# EAGLE design Breakouts1a (EAGLE 7.4.0)
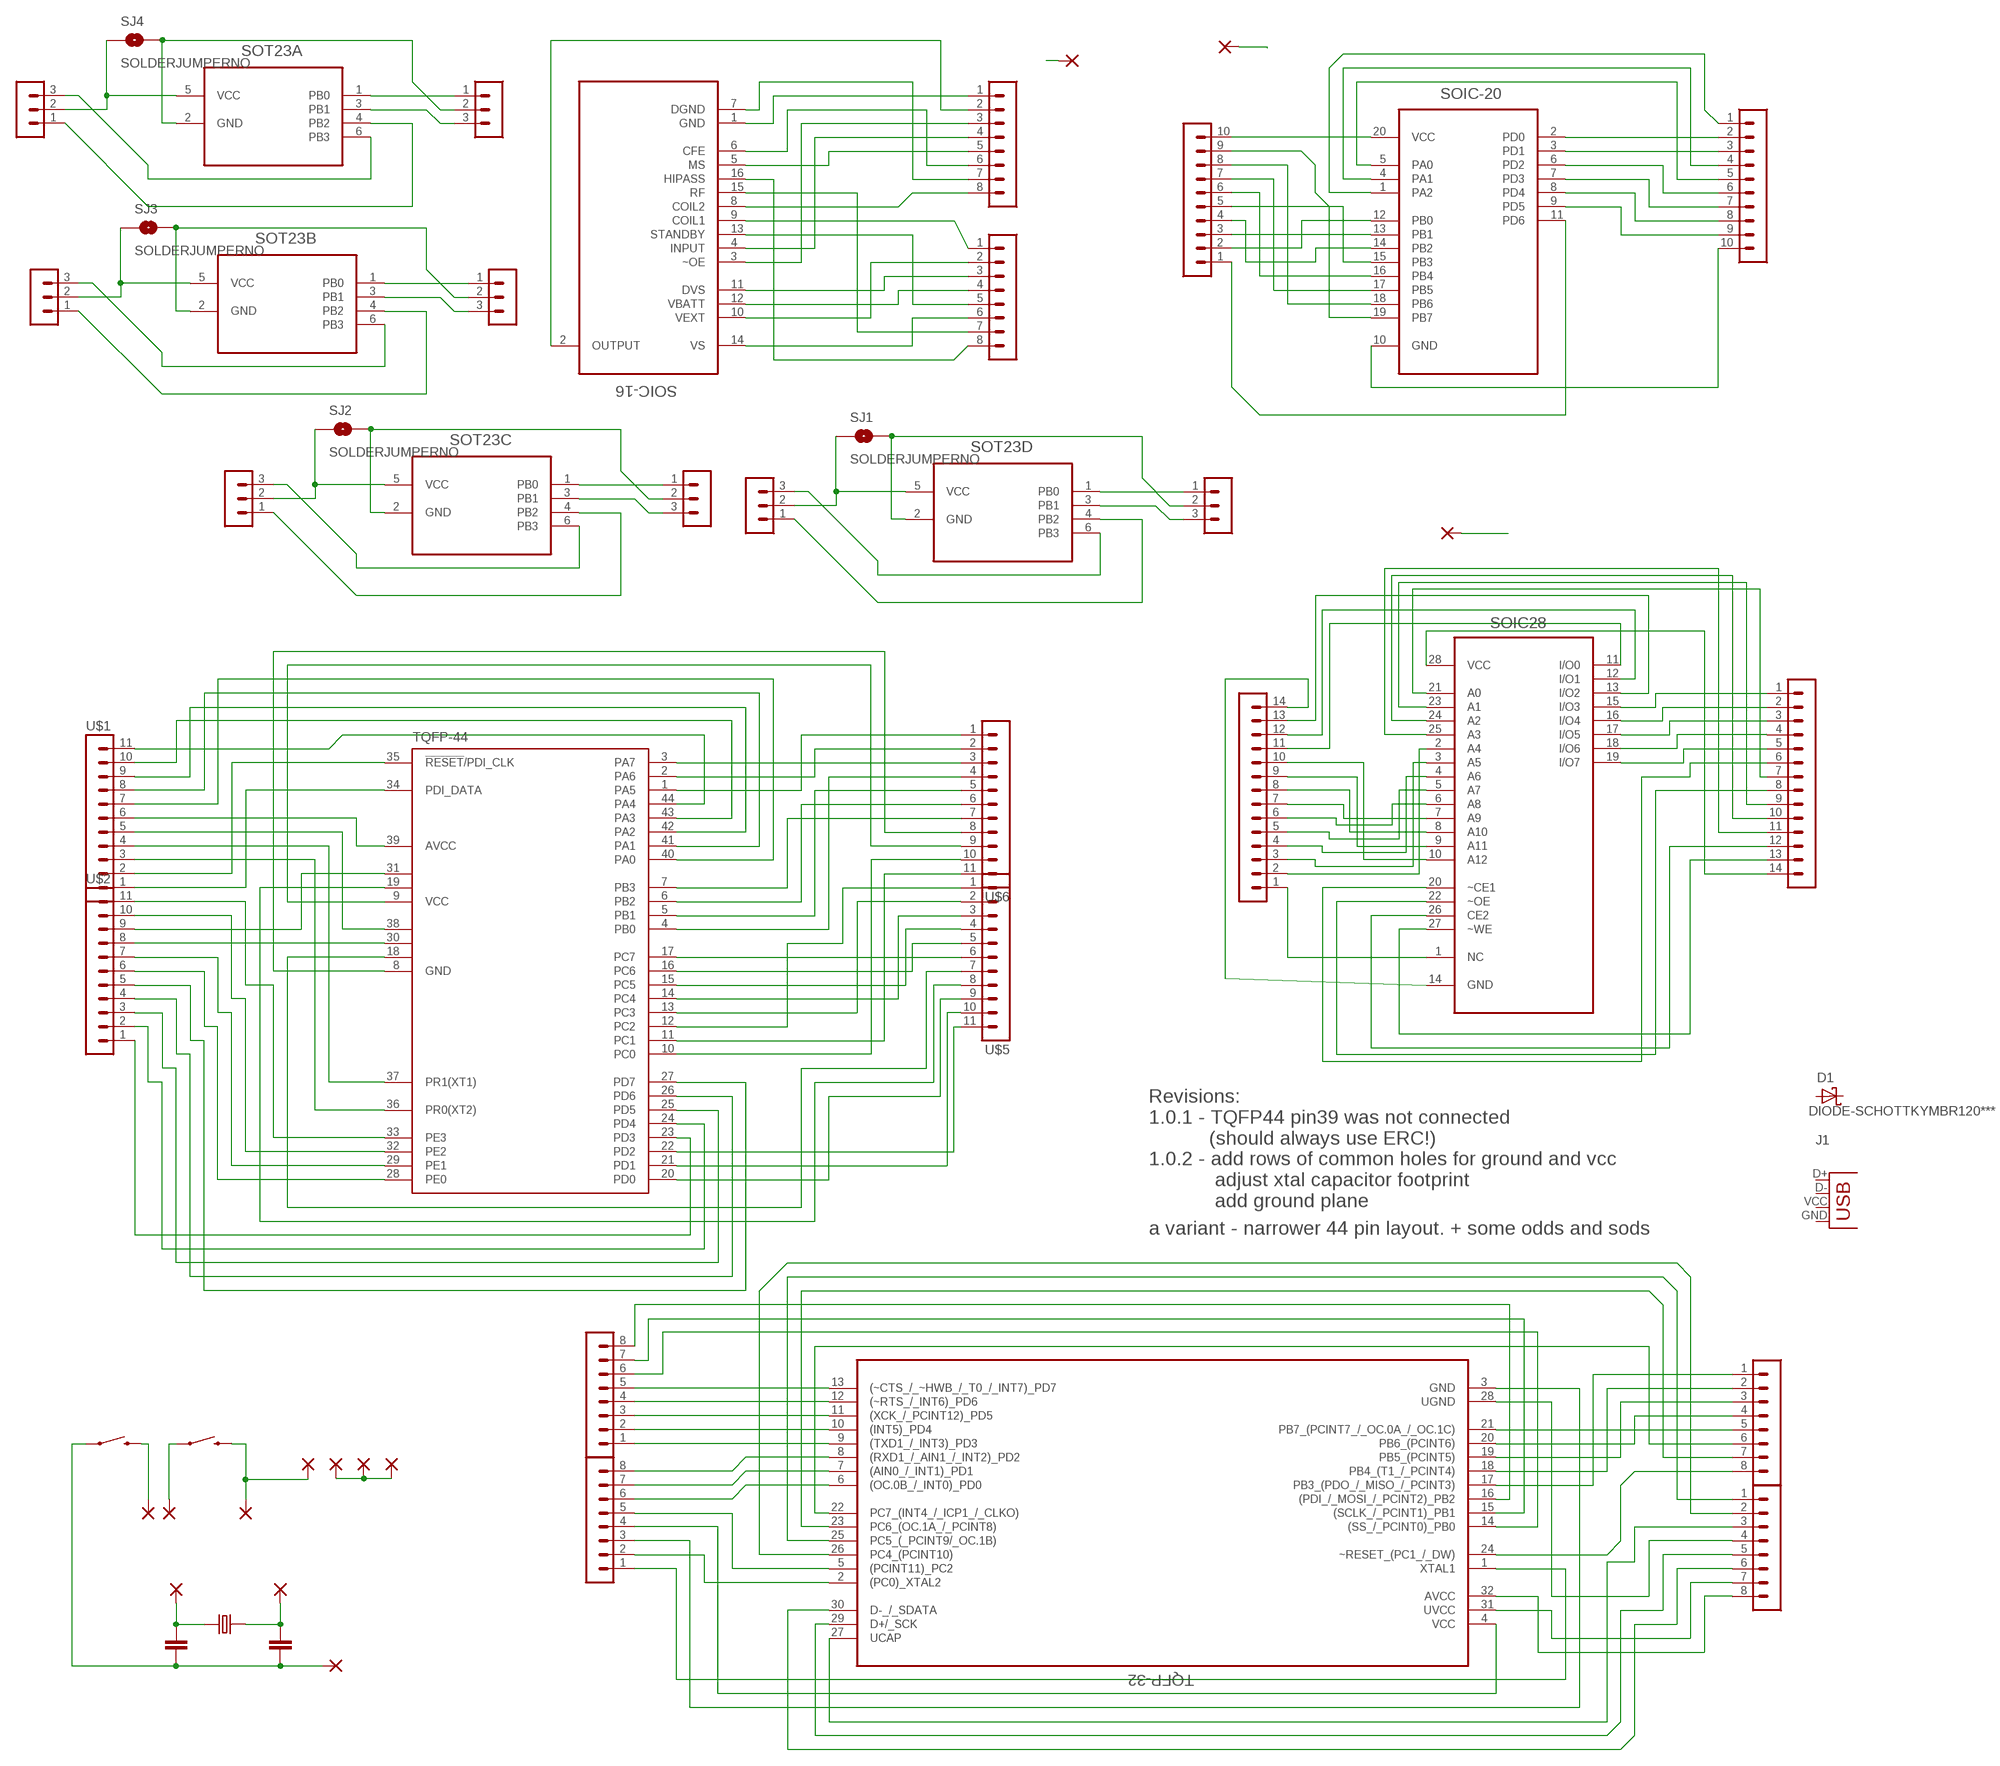
[diagram p0: schematic, sheet 1]

## Parts
C1  C-EU025-024X044**100NF+22PF  [C025-024X044]
C2  C-EU025-024X044**100NF+22PF  [C025-024X044]
D1  DIODE-SCHOTTKYMBR120***  [SOD123]
J1  USB-FCI_SMD***  [FCI_USB_B_SMD]
PAD1  WIREPAD1,6/0,8  [1,6/0,8]
PAD3  WIREPAD1,6/0,8  [1,6/0,8]
PAD4  WIREPAD1,6/0,8  [1,6/0,8]
PAD6  WIREPAD1,6/0,8  [1,6/0,8]
PAD7  WIREPAD1,6/0,8  [1,6/0,8]
PAD8  WIREPAD1,6/0,8  [1,6/0,8]
PAD15  WIREPAD1,6/0,8  [1,6/0,8]
PAD16  WIREPAD1,6/0,8  [1,6/0,8]
PAD17  WIREPAD1,6/0,8  [1,6/0,8]
PAD18  WIREPAD1,6/0,8  [1,6/0,8]
PLANE-SOIC16  WIREPAD1,6/0,8  [1,6/0,8]
PLANE-SOIC20  WIREPAD1,6/0,8  [1,6/0,8]
PLANE-SOIC28  WIREPAD1,6/0,8  [1,6/0,8]
S1  SWITCH-MOMENTARY-2PTH  [TACTILE-PTH]
S2  SWITCH-MOMENTARY-2PTH  [TACTILE-PTH]
SJ1  SOLDERJUMPERNO  [SJ_2S-NO]
SJ2  SOLDERJUMPERNO  [SJ_2S-NO]
SJ3  SOLDERJUMPERNO  [SJ_2S-NO]
SJ4  SOLDERJUMPERNO  [SJ_2S-NO]
SOIC28  CY6264-70SNXC  [SOIC127P1193X253-28N]
SOIC-16  U2270B-MFPY  [SOIC127P600X140-16N]
SOIC-20  ATTINY2313A-SU  [SOIC127P1032X265-20N]
SOT23A  ATTINY10-TSHR  [SOT95P280X145-6N]
SOT23B  ATTINY10-TSHR  [SOT95P280X145-6N]
SOT23C  ATTINY10-TSHR  [SOT95P280X145-6N]
SOT23D  ATTINY10-TSHR  [SOT95P280X145-6N]
SV1  MA08-1  [MA08-1]
SV2  MA08-1  [MA08-1]
SV4  MA08-1  [MA08-1]
SV5  MA14-1  [MA14-1]
SV6  MA10-1  [MA10-1]
SV8  MA08-1  [MA08-1]
SV9  MA14-1  [MA14-1]
SV10  MA03-1  [MA03-1]
SV11  MA03-1  [MA03-1]
SV12  MA03-1  [MA03-1]
SV13  MA03-1  [MA03-1]
SV14  MA03-1  [MA03-1]
SV15  MA03-1  [MA03-1]
SV16  MA08-1  [MA08-1]
SV17  MA10-1  [MA10-1]
SV18  MA08-1  [MA08-1]
SV21  MA03-1  [MA03-1]
SV22  MA03-1  [MA03-1]
TQFP-32  AT90USB162-16AU  [QFP80P900X900X120-32N]
TQFP-44  XMEGA16A4A  [TQFP44]
U$1  MA11-1  [MA11-1S]
U$2  MA11-1  [MA11-1S]
U$5  MA11-1  [MA11-1S]
U$6  MA11-1  [MA11-1S]
X1  CRYSTAL-HC49U-V**16MHZ  [HC49U-V]

## Nets
GND: C1.2 C2.2 PAD8.1(P) S1.1
N$1: TQFP-44.1(PA5) U$6.1
N$2: TQFP-44.2(PA6) U$6.2
N$3: TQFP-44.3(PA7) U$6.3
N$4: TQFP-44.4(PB0) U$6.4
N$5: TQFP-44.5(PB1) U$6.5
N$6: TQFP-44.6(PB2) U$6.6
N$7: TQFP-44.7(PB3) U$6.7
N$8: TQFP-44.8(GND) U$6.8
N$9: TQFP-44.9(VCC) U$6.9
N$10: TQFP-44.12(PC2) U$5.1
N$11: TQFP-44.11(PC1) U$6.11
N$12: TQFP-44.10(PC0) U$6.10
N$13: TQFP-44.13(PC3) U$5.2
N$14: TQFP-44.14(PC4) U$5.3
N$15: TQFP-44.15(PC5) U$5.4
N$16: TQFP-44.16(PC6) U$5.5
N$17: TQFP-44.17(PC7) U$5.6
N$18: TQFP-44.18(GND1) U$5.7
N$19: TQFP-44.19(VCC1) U$5.8
N$20: TQFP-44.20(PD0) U$5.9
N$21: TQFP-44.21(PD1) U$5.10
N$22: TQFP-44.22(PD2) U$5.11
N$23: TQFP-44.23(PD3) U$2.1
N$24: TQFP-44.24(PD4) U$2.2
N$25: SOIC28.1(NC) SV9.1
N$26: SOIC28.2(A4) SV9.2
N$27: SOIC28.3(A5) SV9.3
N$28: SOIC28.4(A6) SV9.4
N$29: SOIC28.5(A7) SV9.5
N$30: SOIC28.6(A8) SV9.6
N$31: SOIC28.7(A9) SV9.7
N$32: SOIC28.8(A10) SV9.8
N$33: TQFP-44.25(PD5) U$2.3
N$34: TQFP-44.26(PD6) U$2.4
N$35: TQFP-44.27(PD7) U$2.5
N$36: TQFP-44.28(PE0) U$2.6
N$37: TQFP-44.29(PE1) U$2.7
N$38: TQFP-44.30(GND2) U$2.8
N$39: TQFP-44.31(VCC2) U$2.9
N$40: TQFP-44.32(PE2) U$2.10
N$41: TQFP-44.33(PE3) U$2.11
N$42: TQFP-44.34(PDI_DATA) U$1.1
N$43: TQFP-44.35(!RESET!/PDI_CLK) U$1.2
N$44: TQFP-44.36(PR0(XT2)) U$1.3
N$45: TQFP-44.37(PR1(XT1)) U$1.4
N$46: SOIC-20.1(PA2) SV6.1
N$47: SOIC-20.2(PD0) SV6.2
N$48: SOIC-20.3(PD1) SV6.3
N$49: SOIC-20.4(PA1) SV6.4
N$50: SOIC-20.5(PA0) SV6.5
N$51: SOIC-20.6(PD2) SV6.6
N$52: SOIC-20.7(PD3) SV6.7
N$53: SOIC-20.8(PD4) SV6.8
N$54: SOIC-20.9(PD5) SV6.9
N$55: SOIC-20.10(GND) SV6.10
N$56: SOIC-20.11(PD6) SV17.1
N$57: SOIC-20.12(PB0) SV17.2
N$58: SOIC-20.13(PB1) SV17.3
N$59: SOIC-20.14(PB2) SV17.4
N$60: SOIC-20.15(PB3) SV17.5
N$61: SOIC-20.16(PB4) SV17.6
N$62: SOIC-20.18(PB6) SV17.8
N$63: SOIC-20.19(PB7) SV17.9
N$64: SOIC-20.20(VCC) SV17.10
N$65: TQFP-44.38(GND3) U$1.5
N$66: TQFP-44.39(AVCC) U$1.6
N$67: TQFP-44.40(PA0) U$1.7
N$68: TQFP-44.41(PA1) U$1.8
N$69: TQFP-44.42(PA2) U$1.9
N$70: TQFP-44.43(PA3) U$1.10
N$71: TQFP-44.44(PA4) U$1.11
N$72: SOIC-20.17(PB5) SV17.7
N$73: SV16.2 TQFP-32.2((PC0)_XTAL2)
N$74: SV16.1 TQFP-32.1(XTAL1)
N$75: SV16.5 TQFP-32.5((PCINT11)_PC2)
N$76: SV16.6 TQFP-32.6((OC.0B_/_INT0)_PD0)
N$77: SV16.7 TQFP-32.7((AIN0_/_INT1)_PD1)
N$78: SV16.8 TQFP-32.8((RXD1_/_AIN1_/_INT2)_PD2)
N$79: SV18.1 TQFP-32.9((TXD1_/_INT3)_PD3)
N$80: SV18.2 TQFP-32.10((INT5)_PD4)
N$81: SV18.3 TQFP-32.11((XCK_/_PCINT12)_PD5)
N$82: SV18.4 TQFP-32.12((~RTS_/_INT6)_PD6)
N$83: SV18.5 TQFP-32.13((~CTS_/_~HWB_/_T0_/_INT7)_PD7)
N$84: SV16.4 TQFP-32.4(VCC)
N$85: SV16.3 TQFP-32.3(GND)
N$86: SV18.8 TQFP-32.16((PDI_/_MOSI_/_PCINT2)_PB2)
N$87: SV18.7 TQFP-32.15((SCLK_/_PCINT1)_PB1)
N$88: SV18.6 TQFP-32.14((SS_/_PCINT0)_PB0)
N$89: SV4.1 TQFP-32.17(PB3_(PDO_/_MISO_/_PCINT3))
N$90: SV4.2 TQFP-32.18(PB4_(T1_/_PCINT4))
N$91: SV4.3 TQFP-32.19(PB5_(PCINT5))
N$92: SV4.4 TQFP-32.20(PB6_(PCINT6))
N$93: SV4.5 TQFP-32.21(PB7_(PCINT7_/_OC.0A_/_OC.1C))
N$94: SV4.6 TQFP-32.22(PC7_(INT4_/_ICP1_/_CLKO))
N$95: SV4.7 TQFP-32.23(PC6_(OC.1A_/_PCINT8))
N$96: SV4.8 TQFP-32.24(~RESET_(PC1_/_DW))
N$97: SV8.1 TQFP-32.25(PC5_(_PCINT9/_OC.1B))
N$98: SV8.2 TQFP-32.26(PC4_(PCINT10))
N$99: SV8.3 TQFP-32.27(UCAP)
N$100: SV8.4 TQFP-32.28(UGND)
N$101: SV8.5 TQFP-32.29(D+/_SCK)
N$102: SV8.6 TQFP-32.30(D-_/_SDATA)
N$103: SV8.7 TQFP-32.31(UVCC)
N$104: SV8.8 TQFP-32.32(AVCC)
N$105: SOIC-16.1(GND) SV1.1
N$106: SOIC-16.2(OUTPUT) SV1.2
N$107: SOIC-16.3(~OE) SV1.3
N$108: SOIC-16.4(INPUT) SV1.4
N$109: SOIC-16.5(MS) SV1.5
N$110: SOIC-16.6(CFE) SV1.6
N$111: SOIC-16.7(DGND) SV1.7
N$112: SOIC-16.8(COIL2) SV1.8
N$113: SOIC-16.9(COIL1) SV2.1
N$114: SOIC-16.10(VEXT) SV2.2
N$115: SOIC-16.11(DVS) SV2.3
N$116: SOIC-16.12(VBATT) SV2.4
N$117: SOIC-16.13(STANDBY) SV2.5
N$118: SOIC-16.14(VS) SV2.6
N$119: SOIC-16.15(RF) SV2.7
N$120: SOIC-16.16(HIPASS) SV2.8
N$121: SOT23C.1(PB0) SV22.1
N$122: SJ2.2 SOT23C.2(GND) SV22.2
N$123: SOT23C.3(PB1) SV22.3
N$124: SOT23C.4(PB2) SV21.1
N$125: SJ2.1 SOT23C.5(VCC) SV21.2
N$126: SOT23C.6(PB3) SV21.3
N$127: SOIC28.9(A11) SV9.9
N$128: SOIC28.10(A12) SV9.10
N$129: SOIC28.11(I/O0) SV9.11
N$130: SOIC28.12(I/O1) SV9.12
N$131: SOIC28.13(I/O2) SV9.13
N$132: SOIC28.14(GND) SV9.14
N$133: SOIC28.15(I/O3) SV5.1
N$134: SOIC28.16(I/O4) SV5.2
N$135: SOIC28.17(I/O5) SV5.3
N$136: SOIC28.18(I/O6) SV5.4
N$137: SOIC28.19(I/O7) SV5.5
N$138: SOIC28.20(~CE1) SV5.6
N$139: SOIC28.21(A0) SV5.7
N$140: SOIC28.22(~OE) SV5.8
N$141: SOIC28.23(A1) SV5.9
N$142: SOIC28.24(A2) SV5.10
N$143: SOIC28.25(A3) SV5.11
N$144: SOIC28.26(CE2) SV5.12
N$145: SOIC28.27(~WE) SV5.13
N$146: SOIC28.28(VCC) SV5.14
N$147: SOT23B.1(PB0) SV11.1
N$148: SJ3.2 SOT23B.2(GND) SV11.2
N$149: SOT23B.3(PB1) SV11.3
N$150: SOT23B.4(PB2) SV10.1
N$151: SJ3.1 SOT23B.5(VCC) SV10.2
N$152: SOT23B.6(PB3) SV10.3
N$153: SOT23D.1(PB0) SV13.1
N$154: SJ1.2 SOT23D.2(GND) SV13.2
N$155: SOT23D.3(PB1) SV13.3
N$156: SOT23D.4(PB2) SV12.1
N$157: SJ1.1 SOT23D.5(VCC) SV12.2
N$158: SOT23D.6(PB3) SV12.3
N$159: SOT23A.1(PB0) SV15.1
N$160: SJ4.2 SOT23A.2(GND) SV15.2
N$161: SOT23A.3(PB1) SV15.3
N$162: SOT23A.4(PB2) SV14.1
N$163: SJ4.1 SOT23A.5(VCC) SV14.2
N$164: SOT23A.6(PB3) SV14.3
N$166: PAD1.1(P) S1.3
N$167: PAD4.1(P) S2.1
N$169: C2.1 PAD6.1(P) X1.1
N$170: C1.1 PAD7.1(P) X1.2
N$171: PAD16.1(P) PAD17.1(P) PAD18.1(P)
PLANE-SOIC16: PLANE-SOIC16.1(P)
PLANE-SOIC20: PLANE-SOIC20.1(P)
PLANE-SOIC28: PLANE-SOIC28.1(P)
PLANE-TQFP32: PAD3.1(P) PAD15.1(P) S2.3
Unconnected: D1.A D1.K(C) J1.D+ J1.D- J1.GND J1.VCC(VBUS)

## Notes on the sheet
- Revisions:
  1.0.1 - TQFP44 pin39 was not connected
             (should always use ERC!)
  1.0.2 - add rows of common holes for ground and vcc
              adjust xtal capacitor footprint
              add ground plane
- a variant - narrower 44 pin layout. + some odds and sods

## Library data of the parts
C1 C2 = Astronomical Clocks old:C-EU: CAPACITOR, European symbol
D1 = Master2:DIODE-SCHOTTKY: DIODE high speed (Philips)
J1 = Master2:USB: USB Connectors USB-B-PTH is fully proven SKU : PRT-00139 USB-miniB is fully proven SKU : PRT-00587 USB-A-PCB is untested. USB-A-H is throughly reviewed, but untested. Spark Fun Electronics SKU : PRT-00437 USB-B-SMT is throughly reviewed, but untested. Needs silkscreen touching up. USB-A-S has not been used/tested USB-MB-H has not been used/tested
PAD1 PAD3 PAD4 PAD6-PAD8 PAD15-PAD18 PLANE-SOIC16 PLANE-SOIC20 PLANE-SOIC28 = Astronomical Clocks old:WIREPAD: Wire PAD connect wire on PCB
S1 S2 = SMD Pads:SWITCH-MOMENTARY-2: Various NO switches- pushbuttons, reed, etc
SJ1-SJ4 = Astronomical Clocks:SOLDERJUMPER: Solder Jumper Standard SMD solder jumper. Used to automate production. Two varients : Normally Open and Normally Closed are the same, but have different paste layers. NC will have a large amount of paste and should jumper during reflow.
SOIC28 = SMD Pads:CY6264-70SNXC: 8K x 8 Static RAM; DESCRIPTION: 8K x 8 Static RAM; MPN: CY6264-70SNXC; OC_FARNELL: 8911460; OC_NEWARK: 19M2607; PACKAGE: SOIC-28; SUPPLIER: CYPRESS SEMICONDUCTOR
SOIC-16 = Atmel_By_element14_Batch_1:U2270B-MFPY: Read/Write Base Station; MPN: U2270B-MFPY; OC_FARNELL: 1095806; OC_NEWARK: 93K1097; PACKAGE: SOIC-16; SUPPLIER: ATMEL
SOIC-20 = Atmel_By_element14_Batch_1:ATTINY2313A-SU: 8-bit Microcontroller with In-System Programmable Flash; MPN: ATTINY2313A-SU; OC_FARNELL: 1841617; OC_NEWARK: 12T1334; PACKAGE: SOIC-20; SUPPLIER: Atmel
SOT23A SOT23B SOT23C SOT23D = Atmel_By_element14_Batch_1:ATTINY10-TSHR: 8-bit Microcontroller with In-System Programmable Flash; MPN: ATTINY10-TSHR; OC_FARNELL: 1748538; OC_NEWARK: 26R5645; PACKAGE: SOT-23-6; SUPPLIER: Atmel
SV1 SV2 SV4 SV8 SV16 SV18 = SMD Pads:MA08-1: PIN HEADER; OC_FARNELL: unknown; OC_NEWARK: unknown
SV5 SV9 = SMD Pads:MA14-1: PIN HEADER; OC_FARNELL: unknown; OC_NEWARK: unknown
SV6 SV17 = SMD Pads:MA10-1: PIN HEADER; OC_FARNELL: unknown; OC_NEWARK: unknown
SV10-SV15 SV21 SV22 = SMD Pads:MA03-1: PIN HEADER; OC_FARNELL: unknown; OC_NEWARK: unknown
TQFP-32 = Atmel_By_element14_Batch_1:AT90USB162-16AU: 8-bit Microcontroller; MPN: AT90USB162-16AU; OC_FARNELL: 1455073; OC_NEWARK: 58M3868; PACKAGE: TQFP-32; SUPPLIER: Atmel
TQFP-44 = atmel:XMEGA16A4: MICROCONTROLLER Features High-performance, Low-power 8/16-bit AVR XMEGA Microcontroller Non-Volatile Program and Data Memories - 16 KB - 128 KB of In-System Self-Programmable Flash - 4 KB - 8 KB Boot Code Section with Independent Lock Bits - 1 KB - 2 KB EEPROM - 2 KB - 8 KB Internal SRAM Peripheral Features - Four-channel DMA Controller with support for external requests - Eight-channel Event System - Five 16-bit Timer/Counters Three Timer/Counters with 4 Output Compare or Input Capture channels Two Timer/Counters with 2 Output Compare or Input Capture channels High-Resolution Extensions on all Timer/Counters Advanced Waveform Extension on one Timer/Counter - Five USARTs IrDA Extension on one USART - Two Two-Wire Interfaces with dual address match (I2C and SMBus compatible) - Two SPIs (Serial Peripheral Interfaces) peripherals - AES and DES Crypto Engine - 16-bit Real Time Counter with Separate Oscillator - One Twelve-channel, 12-bit, 2 Msps Analog to Digital Converter - One Two-channel, 12-bit, 1 Msps Digital to Analog Converter - Two Analog Comparators with Window compare function - External Interrupts on all General Purpose I/O pins - Programmable Watchdog Timer with Separate On-chip Ultra Low Power Oscillator Special Microcontroller Features - Power-on Reset and Programmable Brown-out Detection - Internal and External Clock Options with PLL - Programmable Multi-level Interrupt Controller - Sleep Modes: Idle, Power-down, Standby, Power-save, Extended Standby - Advanced Programming, Test and Debugging Interfaces PDI (Program and Debug Interface) for programming, test and debugging I/O and Packages - 34 Programmable I/O Lines - 44 - lead TQFP - 44 - pad VQFN/QFN - 49 - ball VFBGA Operating Voltage - 1.6 - 3.6V Speed performance - 0 - 12 MHz @ 1.6 - 3.6V - 0 - 32 MHz @ 2.7 - 3.6V Drawn by Dipl.-Ing. (FH) Robert Siegler Created: 27.05.09; OC_FARNELL: unknown; OC_NEWARK: unknown
U$1 U$2 U$5 U$6 = Master2:MA11-1
X1 = Astronomical Clocks old:CRYSTAL*: CRYSTAL

## Board
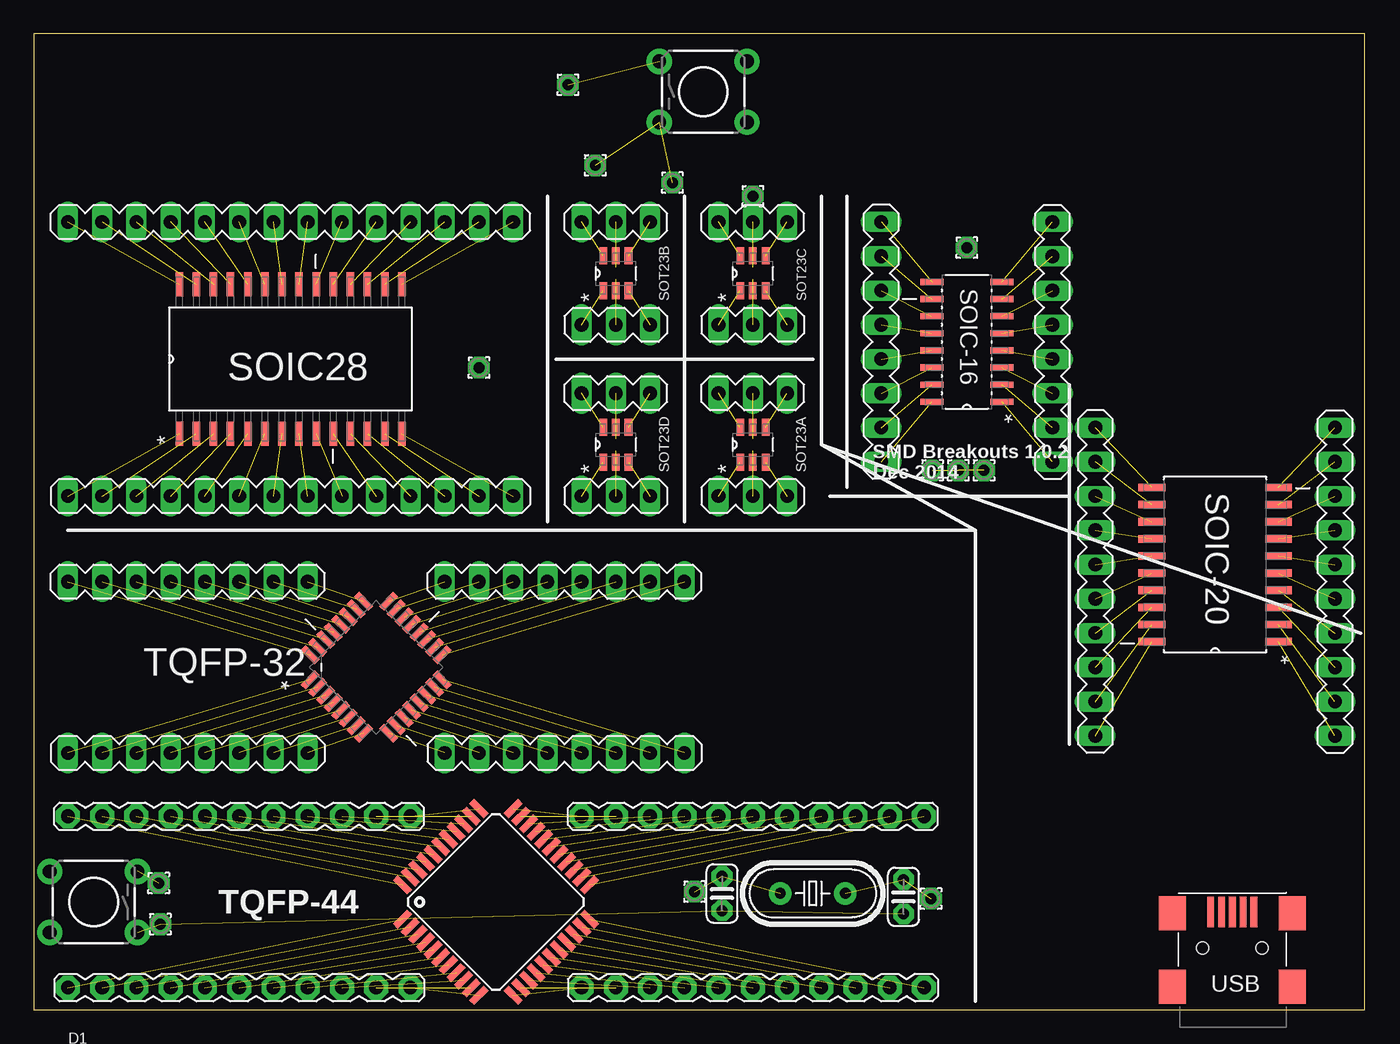
[diagram p1: board, top side]
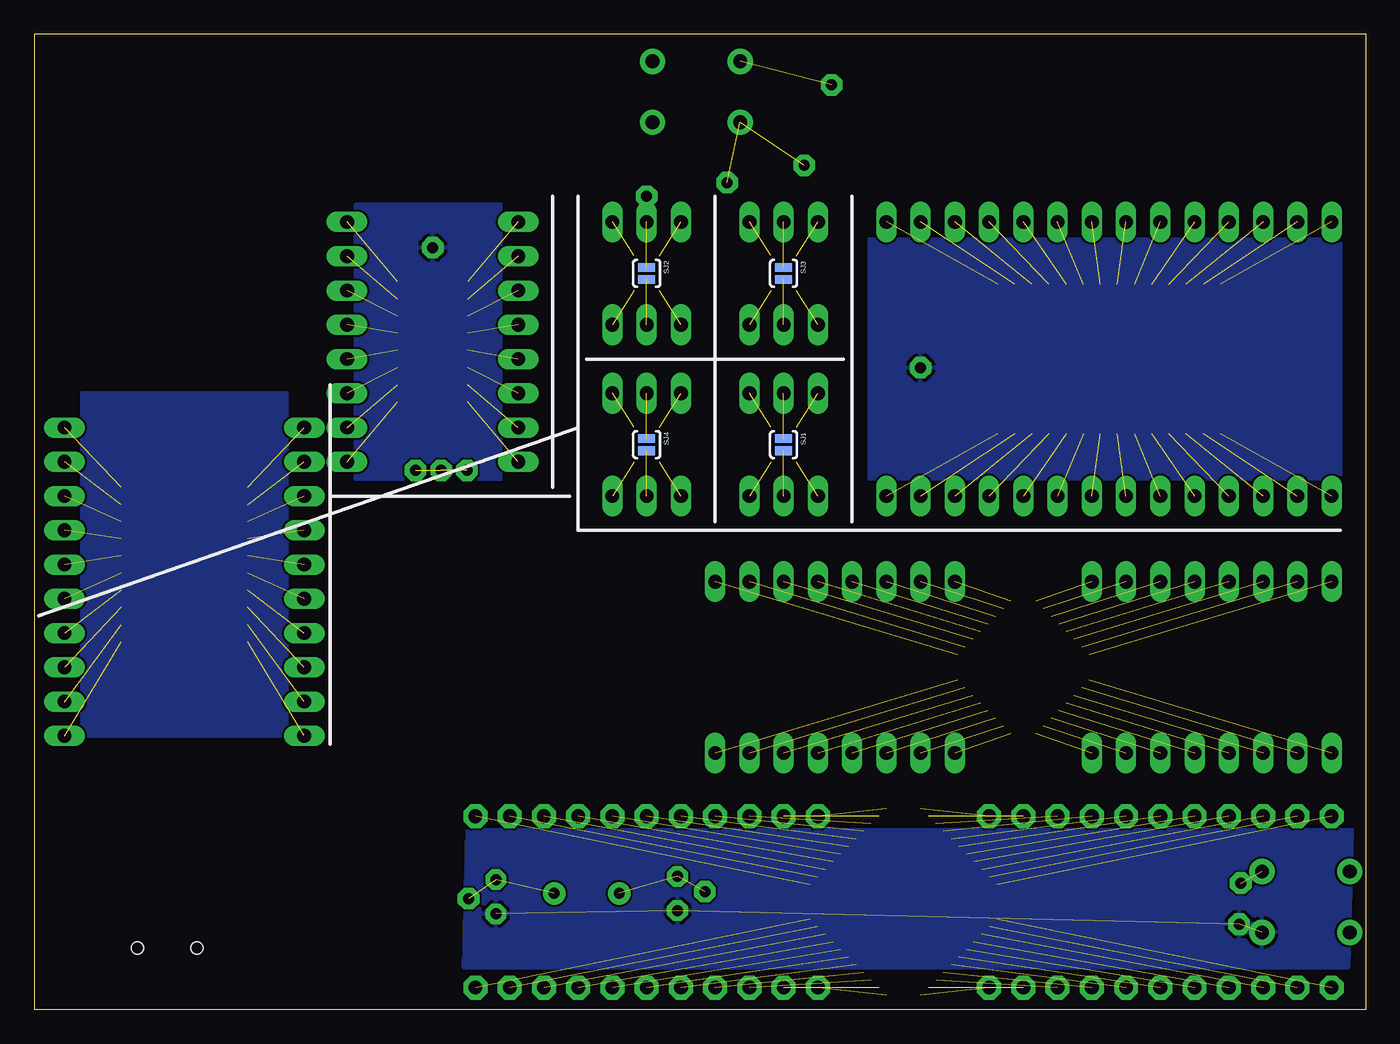
[diagram p2: board, bottom side, seen from below]

Size 98.73 x 72.38 mm. Coordinates in mm from the lower left corner, seen from the top.
Outline: 0,0 98.73,0 98.73,72.38 0,72.38 0,0
Copper layers (1*16): Top 0.035mm / dielectric 1.5mm / Bottom 0.035mm
Design rules "Seeed Fusion_eagle_rule_v1.1": minimum track width 6mil, minimum drill 12mil, track to track 6mil, track to pad 6mil, pad to pad 6mil, via to via 6mil, smd to smd 0mil, copper to edge 10mil, drill to drill 10mil, minimum pad ring 10mil, minimum via ring 6mil, stop-mask expansion 2mil, vias tented up to drill 100mil, thermal gap 10mil
tRestrict: 2 lines
bRestrict: 2 lines

### Footprints (pad centres in the part's own frame; a part is rotated, then mirrored left to right if it is on the bottom)
C025-024X044 = drill 0.813 pad 1.524 octagon: 1 -1.27,0; 2 1.27,0
SOD123 = smd 1.5 x 1.25: A 1.93,0; K -1.93,0
FCI_USB_B_SMD = smd 0.5 x 2.25: D+ 0,8.525; D- -0.8,8.525; GND 1.6,8.525; ID 0.8,8.525; VCC -1.6,8.525 | smd 2 x 2.5: SH$1 -4.45,8.43; SH$2 4.45,8.43; SH$3 4.45,2.98; SH$4 -4.45,2.98 | hole 0.9: -2.2,5.85; 2.2,5.85
1,6/0,8 = drill 0.813 pad 1.6 octagon: 1 0,0
TACTILE-PTH = drill 1.016 pad 1.88: 1 -3.251,2.261; 2 3.251,2.261; 3 -3.251,-2.261; 4 3.251,-2.261
SJ_2S-NO = smd 0.635 x 1.27: 1 -0.45,0; 2 0.45,0
SOIC127P1193X253-28N = smd 1.778 x 0.559: 1 -5.537,8.255; 2 -5.537,6.985; 3 -5.537,5.715; 4 -5.537,4.445; 5 -5.537,3.175; 6 -5.537,1.905; 7 -5.537,0.635; 8 -5.537,-0.635; 9 -5.537,-1.905; 10 -5.537,-3.175; 11 -5.537,-4.445; 12 -5.537,-5.715; 13 -5.537,-6.985; 14 -5.537,-8.255; 15 5.537,-8.255; 16 5.537,-6.985; 17 5.537,-5.715; 18 5.537,-4.445; 19 5.537,-3.175; 20 5.537,-1.905; 21 5.537,-0.635; 22 5.537,0.635; 23 5.537,1.905; 24 5.537,3.175; 25 5.537,4.445; 26 5.537,5.715; 27 5.537,6.985; 28 5.537,8.255
SOIC127P600X140-16N = smd 1.702 x 0.457: 1 -2.591,4.445; 2 -2.591,3.175; 3 -2.591,1.905; 4 -2.591,0.635; 5 -2.591,-0.635; 6 -2.591,-1.905; 7 -2.591,-3.175; 8 -2.591,-4.445; 9 2.591,-4.445; 10 2.591,-3.175; 11 2.591,-1.905; 12 2.591,-0.635; 13 2.591,0.635; 14 2.591,1.905; 15 2.591,3.175; 16 2.591,4.445
SOIC127P1032X265-20N = smd 1.981 x 0.559: 1 -4.699,5.715; 2 -4.699,4.445; 3 -4.699,3.175; 4 -4.699,1.905; 5 -4.699,0.635; 6 -4.699,-0.635; 7 -4.699,-1.905; 8 -4.699,-3.175; 9 -4.699,-4.445; 10 -4.699,-5.715; 11 4.699,-5.715; 12 4.699,-4.445; 13 4.699,-3.175; 14 4.699,-1.905; 15 4.699,-0.635; 16 4.699,0.635; 17 4.699,1.905; 18 4.699,3.175; 19 4.699,4.445; 20 4.699,5.715
SOT95P280X145-6N = smd 1.27 x 0.559: 1 -1.295,0.94; 2 -1.295,0; 3 -1.295,-0.94; 4 1.295,-0.94; 5 1.295,0; 6 1.295,0.94
MA08-1 = drill 1.016 long: 1 -8.89,0; 2 -6.35,0; 3 -3.81,0; 4 -1.27,0; 5 1.27,0; 6 3.81,0; 7 6.35,0; 8 8.89,0
MA14-1 = drill 1.016 long: 1 -16.51,0; 2 -13.97,0; 3 -11.43,0; 4 -8.89,0; 5 -6.35,0; 6 -3.81,0; 7 -1.27,0; 8 1.27,0; 9 3.81,0; 10 6.35,0; 11 8.89,0; 12 11.43,0; 13 13.97,0; 14 16.51,0
MA10-1 = drill 1.016 long: 1 -11.43,0; 2 -8.89,0; 3 -6.35,0; 4 -3.81,0; 5 -1.27,0; 6 1.27,0; 7 3.81,0; 8 6.35,0; 9 8.89,0; 10 11.43,0
MA03-1 = drill 1.016 long: 1 -2.54,0; 2 0,0; 3 2.54,0
QFP80P900X900X120-32N = smd 1.473 x 0.508: 1 -4.115,2.794; 2 -4.115,2.007; 3 -4.115,1.194; 4 -4.115,0.406; 5 -4.115,-0.406; 6 -4.115,-1.194; 7 -4.115,-2.007; 8 -4.115,-2.794; 17 4.115,-2.794; 18 4.115,-2.007; 19 4.115,-1.194; 20 4.115,-0.406; 21 4.115,0.406; 22 4.115,1.194; 23 4.115,2.007; 24 4.115,2.794 | smd 0.508 x 1.473: 9 -2.794,-4.115; 10 -2.007,-4.115; 11 -1.194,-4.115; 12 -0.406,-4.115; 13 0.406,-4.115; 14 1.194,-4.115; 15 2.007,-4.115; 16 2.794,-4.115; 25 2.794,4.115; 26 2.007,4.115; 27 1.194,4.115; 28 0.406,4.115; 29 -0.406,4.115; 30 -1.194,4.115; 31 -2.007,4.115; 32 -2.794,4.115
TQFP44 = smd 1.5 x 0.5: 1 -5.8,4; 2 -5.8,3.2; 3 -5.8,2.4; 4 -5.8,1.6; 5 -5.8,0.8; 6 -5.8,0; 7 -5.8,-0.8; 8 -5.8,-1.6; 9 -5.8,-2.4; 10 -5.8,-3.2; 11 -5.8,-4; 23 5.8,-4; 24 5.8,-3.2; 25 5.8,-2.4; 26 5.8,-1.6; 27 5.8,-0.8; 28 5.8,0; 29 5.8,0.8; 30 5.8,1.6; 31 5.8,2.4; 32 5.8,3.2; 33 5.8,4 | smd 0.5 x 1.5: 12 -4,-5.8; 13 -3.2,-5.8; 14 -2.4,-5.8; 15 -1.6,-5.8; 16 -0.8,-5.8; 17 0,-5.8; 18 0.8,-5.8; 19 1.6,-5.8; 20 2.4,-5.8; 21 3.2,-5.8; 22 4,-5.8; 34 4,5.8; 35 3.2,5.8; 36 2.4,5.8; 37 1.6,5.8; 38 0.8,5.8; 39 0,5.8; 40 -0.8,5.8; 41 -1.6,5.8; 42 -2.4,5.8; 43 -3.2,5.8; 44 -4,5.8
MA11-1S = drill 1.016 pad 1.778 octagon: 1 -12.7,0; 2 -10.16,0; 3 -7.62,0; 4 -5.08,0; 5 -2.54,0; 6 0,0; 7 2.54,0; 8 5.08,0; 9 7.62,0; 10 10.16,0; 11 12.7,0
HC49U-V = drill 0.813 pad 1.676: 1 -2.413,0; 2 2.413,0

### Placement (x,y rotation side)
C1  64.52,8.38 270 top
C2  51.05,8.64 270 top
D1  3.81,-3.81 0 top  (outside the outline)
J1  88.9,-1.27 0 top
PAD1  9.27,9.4 0 top
PAD3  47.37,61.34 0 top
PAD4  39.62,68.58 0 top
PAD6  49.02,8.76 0 top
PAD7  66.55,8.26 0 top
PAD8  9.4,6.35 0 top
PAD15  41.66,62.61 0 top
PAD16  66.67,40.01 0 top
PAD17  68.58,40.01 0 top
PAD18  70.48,40.01 0 top
PLANE-SOIC16  69.22,56.52 0 top
PLANE-SOIC20  53.34,60.33 0 top
PLANE-SOIC28  33.02,47.62 0 top
S1  4.45,8 180 top
S2  49.66,68.07 0 top
SJ1  43.18,41.91 270 bottom
SJ2  53.34,54.61 270 bottom
SJ3  43.18,54.61 270 bottom
SJ4  53.34,41.91 270 bottom
SOIC28  19.05,48.26 90 top
SOIC-16  69.22,49.53 180 top
SOIC-20  87.63,33.02 180 top
SOT23A  53.34,41.91 90 top
SOT23B  43.18,54.61 90 top
SOT23C  53.34,54.61 90 top
SOT23D  43.18,41.91 90 top
SV1  75.56,49.53 90 top
SV2  62.87,49.53 270 top
SV4  39.37,31.75 180 top
SV5  19.05,58.42 180 top
SV6  96.52,31.75 90 top
SV8  11.43,31.75 180 top
SV9  19.05,38.1 0 top
SV10  43.18,58.42 180 top
SV11  43.18,50.8 0 top
SV12  43.18,45.72 180 top
SV13  43.18,38.1 0 top
SV14  53.34,45.72 180 top
SV15  53.34,38.1 0 top
SV16  11.43,19.05 0 top
SV17  78.74,31.75 270 top
SV18  39.37,19.05 0 top
SV21  53.34,58.42 180 top
SV22  53.34,50.8 0 top
TQFP-32  25.4,25.4 45 top
TQFP-44  34.29,8 45 top
U$1  15.24,14.35 180 top
U$2  53.34,14.35 180 top
U$5  53.34,1.65 0 top
U$6  15.24,1.65 0 top
X1  57.78,8.64 0 top

### Tracks (layer width: path | path; a pad name or v marks a point on that pad's centre or on a via)
GND  (3 unrouted)
  pour Bottom: 1.27,3.17 1.02,13.34 66.67,13.34 66.93,3.17
N$1  (1 unrouted)
N$2  (1 unrouted)
N$3  (1 unrouted)
N$4  (1 unrouted)
N$5  (1 unrouted)
N$6  (1 unrouted)
N$7  (1 unrouted)
N$8  (1 unrouted)
N$9  (1 unrouted)
N$10  (1 unrouted)
N$11  (1 unrouted)
N$12  (1 unrouted)
N$13  (1 unrouted)
N$14  (1 unrouted)
N$15  (1 unrouted)
N$16  (1 unrouted)
N$17  (1 unrouted)
N$18  (1 unrouted)
N$19  (1 unrouted)
N$20  (1 unrouted)
N$21  (1 unrouted)
N$22  (1 unrouted)
N$23  (1 unrouted)
N$24  (1 unrouted)
N$25  (1 unrouted)
N$26  (1 unrouted)
N$27  (1 unrouted)
N$28  (1 unrouted)
N$29  (1 unrouted)
N$30  (1 unrouted)
N$31  (1 unrouted)
N$32  (1 unrouted)
N$33  (1 unrouted)
N$34  (1 unrouted)
N$35  (1 unrouted)
N$36  (1 unrouted)
N$37  (1 unrouted)
N$38  (1 unrouted)
N$39  (1 unrouted)
N$40  (1 unrouted)
N$41  (1 unrouted)
N$42  (1 unrouted)
N$43  (1 unrouted)
N$44  (1 unrouted)
N$45  (1 unrouted)
N$46  (1 unrouted)
N$47  (1 unrouted)
N$48  (1 unrouted)
N$49  (1 unrouted)
N$50  (1 unrouted)
N$51  (1 unrouted)
N$52  (1 unrouted)
N$53  (1 unrouted)
N$54  (1 unrouted)
N$55  (1 unrouted)
N$56  (1 unrouted)
N$57  (1 unrouted)
N$58  (1 unrouted)
N$59  (1 unrouted)
N$60  (1 unrouted)
N$61  (1 unrouted)
N$62  (1 unrouted)
N$63  (1 unrouted)
N$64  (1 unrouted)
N$65  (1 unrouted)
N$66  (1 unrouted)
N$67  (1 unrouted)
N$68  (1 unrouted)
N$69  (1 unrouted)
N$70  (1 unrouted)
N$71  (1 unrouted)
N$72  (1 unrouted)
N$73  (1 unrouted)
N$74  (1 unrouted)
N$75  (1 unrouted)
N$76  (1 unrouted)
N$77  (1 unrouted)
N$78  (1 unrouted)
N$79  (1 unrouted)
N$80  (1 unrouted)
N$81  (1 unrouted)
N$82  (1 unrouted)
N$83  (1 unrouted)
N$84  (1 unrouted)
N$85  (1 unrouted)
N$86  (1 unrouted)
N$87  (1 unrouted)
N$88  (1 unrouted)
N$89  (1 unrouted)
N$90  (1 unrouted)
N$91  (1 unrouted)
N$92  (1 unrouted)
N$93  (1 unrouted)
N$94  (1 unrouted)
N$95  (1 unrouted)
N$96  (1 unrouted)
N$97  (1 unrouted)
N$98  (1 unrouted)
N$99  (1 unrouted)
N$100  (1 unrouted)
N$101  (1 unrouted)
N$102  (1 unrouted)
N$103  (1 unrouted)
N$104  (1 unrouted)
N$105  (1 unrouted)
N$106  (1 unrouted)
N$107  (1 unrouted)
N$108  (1 unrouted)
N$109  (1 unrouted)
N$110  (1 unrouted)
N$111  (1 unrouted)
N$112  (1 unrouted)
N$113  (1 unrouted)
N$114  (1 unrouted)
N$115  (1 unrouted)
N$116  (1 unrouted)
N$117  (1 unrouted)
N$118  (1 unrouted)
N$119  (1 unrouted)
N$120  (1 unrouted)
N$121  (1 unrouted)
N$122  (2 unrouted)
N$123  (1 unrouted)
N$124  (1 unrouted)
N$125  (2 unrouted)
N$126  (1 unrouted)
N$127  (1 unrouted)
N$128  (1 unrouted)
N$129  (1 unrouted)
N$130  (1 unrouted)
N$131  (1 unrouted)
N$132  (1 unrouted)
N$133  (1 unrouted)
N$134  (1 unrouted)
N$135  (1 unrouted)
N$136  (1 unrouted)
N$137  (1 unrouted)
N$138  (1 unrouted)
N$139  (1 unrouted)
N$140  (1 unrouted)
N$141  (1 unrouted)
N$142  (1 unrouted)
N$143  (1 unrouted)
N$144  (1 unrouted)
N$145  (1 unrouted)
N$146  (1 unrouted)
N$147  (1 unrouted)
N$148  (2 unrouted)
N$149  (1 unrouted)
N$150  (1 unrouted)
N$151  (2 unrouted)
N$152  (1 unrouted)
N$153  (1 unrouted)
N$154  (2 unrouted)
N$155  (1 unrouted)
N$156  (1 unrouted)
N$157  (2 unrouted)
N$158  (1 unrouted)
N$159  (1 unrouted)
N$160  (2 unrouted)
N$161  (1 unrouted)
N$162  (1 unrouted)
N$163  (2 unrouted)
N$164  (1 unrouted)
N$166  (1 unrouted)
N$167  (1 unrouted)
N$169  (2 unrouted)
N$170  (2 unrouted)
N$171  (2 unrouted)
PLANE-SOIC16
  pour Bottom: 64.14,59.69 74.93,59.69 74.93,39.37 64.14,39.37
PLANE-SOIC20
  pour Bottom: 80.01,45.72 95.25,45.72 95.25,20.32 80.01,20.32
PLANE-SOIC28
  pour Bottom: 1.91,57.15 1.91,39.37 36.83,39.37 36.83,57.15
PLANE-TQFP32  (2 unrouted)

### Text on the board
tPlace: SMD Breakouts 1.0.2 / Dec 2014
tNames: TQFP-44
tValues: Reset | GND